# EAGLE schematic RobotSide (EAGLE 9.5.2)

## Sheet 1 of 2
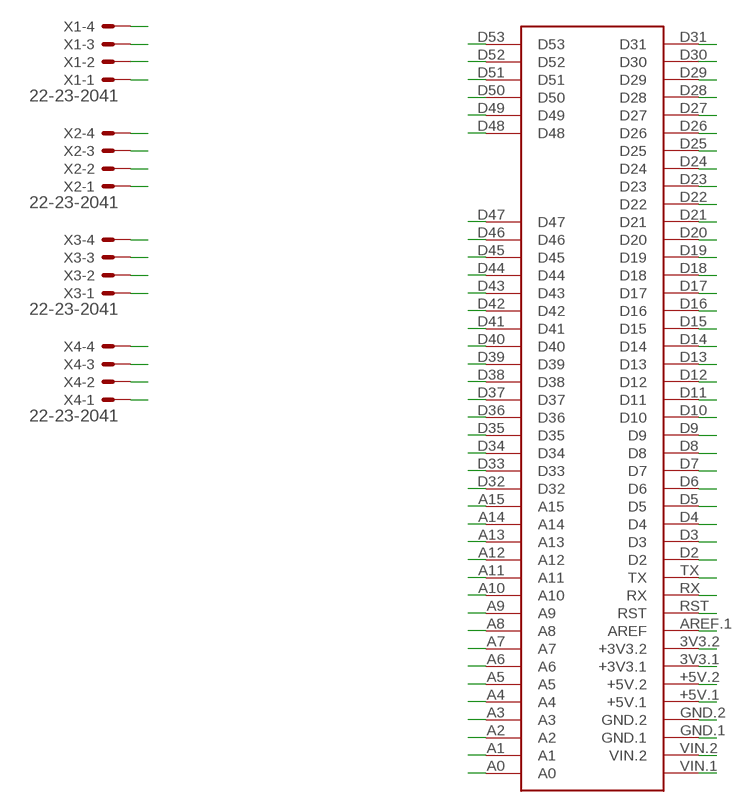
[diagram p0: schematic, sheet 1]

### Parts
U$1  MEGA2560_MIKRO  [MEGA2560_MIKRO]
X1  22-23-2041  [22-23-2041]
X2  22-23-2041  [22-23-2041]
X3  22-23-2041  [22-23-2041]
X4  22-23-2041  [22-23-2041]

### Nets
3V3: U$1.3V3.1(+3V3.1) U$1.3V3.2(+3V3.2)
5V: U$1.+5V.1 U$1.+5V.2 ; also sheet 2
A0: U$1.A0
A1: U$1.A1
A2: U$1.A2
A3: U$1.A3
A4: U$1.A4
A5: U$1.A5
A6: U$1.A6
A7: U$1.A7
A8: U$1.A8
A9: U$1.A9
A10: U$1.A10
A11: U$1.A11
A12: U$1.A12
A13: U$1.A13
A14: U$1.A14
A15: U$1.A15
AREF: U$1.AREF.1(AREF)
D2: U$1.D2
D3: U$1.D3
D4: U$1.D4
D5: U$1.D5
D6: U$1.D6
D7: U$1.D7
D8: U$1.D8
D9: U$1.D9
D10: U$1.D10
D11: U$1.D11
D12: U$1.D12
D13: U$1.D13
D14: U$1.D14
D15: U$1.D15
D16: U$1.D16
D17: U$1.D17
D18: U$1.D18
D19: U$1.D19
D20: U$1.D20
D21: U$1.D21
D22: U$1.D22
D23: U$1.D23
D24: U$1.D24
D25: U$1.D25
D26: U$1.D26
D27: U$1.D27
D28: U$1.D28
D29: U$1.D29
D30: U$1.D30
D31: U$1.D31
D32: U$1.D32
D33: U$1.D33
D34: U$1.D34
D35: U$1.D35
D36: U$1.D36
D37: U$1.D37
D38: U$1.D38
D39: U$1.D39
D40: U$1.D40
D41: U$1.D41
D42: U$1.D42
D43: U$1.D43
D44: U$1.D44
D45: U$1.D45
D46: U$1.D46
D47: U$1.D47
D49: U$1.D49
D50: U$1.D50
D51: U$1.D51
D52: U$1.D52
D53: U$1.D53
GND: U$1.GND.1 U$1.GND.2 ; also sheet 2
N$1: X1.4
N$2: X1.3
N$3: X1.2
N$4: X1.1
N$5: X2.4
N$6: X2.3
N$7: X2.2
N$8: X2.1
N$9: X3.4
N$10: X3.3
N$11: X3.2
N$12: X3.1
N$13: X4.4
N$14: X4.3
N$15: X4.2
N$16: X4.1
N$33: U$1.D48
RST: U$1.RST
RX0: U$1.RX
TX0: U$1.TX
VIN: U$1.VIN.1 U$1.VIN.2

## Sheet 2 of 2
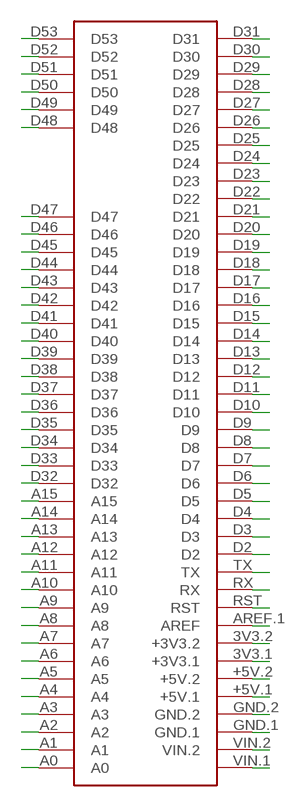
[diagram p1: schematic, sheet 2]

### Parts
U$2  MEGA2560_MIKRO  [MEGA2560_MIKRO]

### Nets
3V3_A: U$2.3V3.1(+3V3.1) U$2.3V3.2(+3V3.2)
5V: U$2.+5V.1 U$2.+5V.2 ; also sheet 1
A0_A: U$2.A0
A1_A: U$2.A1
A2_A: U$2.A2
A3_A: U$2.A3
A4_A: U$2.A4
A5_A: U$2.A5
A6_A: U$2.A6
A7_A: U$2.A7
A8_A: U$2.A8
A9_A: U$2.A9
A10_A: U$2.A10
A11_A: U$2.A11
A12_A: U$2.A12
A13_A: U$2.A13
A14_A: U$2.A14
A15_A: U$2.A15
AREF_A: U$2.AREF.1(AREF)
D2_A: U$2.D2
D3_A: U$2.D3
D4_A: U$2.D4
D5_A: U$2.D5
D6_A: U$2.D6
D7_A: U$2.D7
D8_A: U$2.D8
D9_A: U$2.D9
D10_A: U$2.D10
D11_A: U$2.D11
D12_A: U$2.D12
D13_A: U$2.D13
D14_A: U$2.D14
D15_A: U$2.D15
D16_A: U$2.D16
D17_A: U$2.D17
D18_A: U$2.D18
D19_A: U$2.D19
D20_A: U$2.D20
D21_A: U$2.D21
D22_A: U$2.D22
D23_A: U$2.D23
D24_A: U$2.D24
D25_A: U$2.D25
D26_A: U$2.D26
D27_A: U$2.D27
D28_A: U$2.D28
D29_A: U$2.D29
D30_A: U$2.D30
D31_A: U$2.D31
D32_A: U$2.D32
D33_A: U$2.D33
D34_A: U$2.D34
D35_A: U$2.D35
D36_A: U$2.D36
D37_A: U$2.D37
D38_A: U$2.D38
D39_A: U$2.D39
D40_A: U$2.D40
D41_A: U$2.D41
D42_A: U$2.D42
D43_A: U$2.D43
D44_A: U$2.D44
D45_A: U$2.D45
D46_A: U$2.D46
D47_A: U$2.D47
D48_A: U$2.D48
D49_A: U$2.D49
D50_A: U$2.D50
D51_A: U$2.D51
D52_A: U$2.D52
D53_A: U$2.D53
GND: U$2.GND.1 U$2.GND.2 ; also sheet 1
RST_A: U$2.RST
RX0_A: U$2.RX
TX0_A: U$2.TX
VIN_A: U$2.VIN.1 U$2.VIN.2

## Library data of the parts
U$1 U$2 = MIKRO_MEGA2560:MEGA2560_MIKRO: Arduino Mega2560 pro robotDyn, create by mikroavr.com
X1-X4 = con-molex:22-23-2041: .100" (2.54mm) Center Header - 4 Pin; MF: MOLEX; MPN: 22-23-2041; OC_FARNELL: 1462920; OC_NEWARK: 38C0355